# Altium schematic sheet Communications.SchDoc: Communications
size Tabloid; CompanyName: Vertex; Organization: Vertex Downhole Ltd.; Address1: 7004 5 St SE Unit C; Address2: Calgary, AB; Address3: T2H 2G3; Address4: Canada; DocumentNumber: 550014; Revision: 4.1; SheetNumber: 6; SheetTotal: 8; Operating Temperature Range: -55°C ~ 230°C
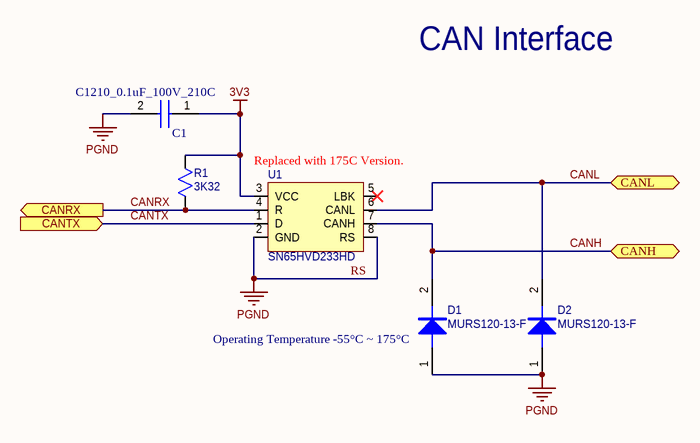
[diagram p0: Communications.SchDoc]

## Parts
C1  C1210_0.1uF_100V_210C  [C1210]
D1  MURS120-13-F  [SMB-D]
D2  MURS120-13-F  [SMB-D]
R1  3K32  [0603]
U1  SN65HVD233HD  [D8]

## Ports
CANH (bidir), CANL (bidir), CANRX (out), CANTX (in)

## Nets
3V3: C1.1 R1.2 U1.3(VCC)
RS: C1.2 D1.1(A) D2.1(A) U1.2(GND) U1.8(RS)  [also labelled PGND]
CANH: D1.2(K) U1.7(CANH) ; port CANH
CANL: D2.2(K) U1.6(CANL) ; port CANL
CANRX: R1.1 U1.4(R) ; port CANRX
CANTX: U1.1(D) ; port CANTX

Not connected (* = marked no-connect by the designer): U1 5(LBK)*

## Notes on the sheet
- CAN Interface
- (near U1) Replaced with 175C Version.
- (near D1) Operating Temperature -55°C ~ 175°C
- Title
- Size:
- Date:
- Tabloid
- Number:
- Time:
- Revision:
- Sheet
- of
- File:

## Library data of the parts
C1 = C1210H104J1GACTU: Capacitor; Manufacturer_Name: KEMET; Datasheet Link: https://content.kemet.com/datasheets/KEM_C1001_C0G_200C_SMD.pdf; Manufacturer_Part_Number: C1210H104J1GACTU; Mouser Part Number: 80-C1210H104J1GACTU; Mouser Price/Stock: https://www.mouser.co.uk/ProductDetail/KEMET/C1210H104J1GACTU?qs=w3%252Bcv6FlocpP4mccX4tnSA%3D%3D; Operating Temperature Range: -55C to +200C
D1 D2 = DIODE_1: Diode; Manufacturer: Diodes Inc.; Vendor: Digi-Key; Vendor PN: MURS120-FDITR-ND; Vertex PN: 6600001-01; Manu PN: MURS120-13-F
R1 = RES_3K32_0603_1%_1/10W: 3.32K OHM 1% 1/8W 0603; Manufacturer: Vishay; Vendor PN: 541-MCT0603MC3321FP500TR-ND; Vendor: Digi-Key; Manu PN: MCT0603MC3321FP500; Vertex PN: TBD; Supplier 1: Digikey; Supplier Part Number 1: 541-MCT0603MC3321FP500TR-ND
U1 = SN65HVD233HD: CAN Transceiver, 3V3; Manufacturer: TI; Vendor: DigiKey; Vendor PN: 296-28288-5-ND; Vertex PN: TBD; MPN: SN65HVD233HD; Footprint: SOIC-8; Operating Temperature Range: '-55C to 175C